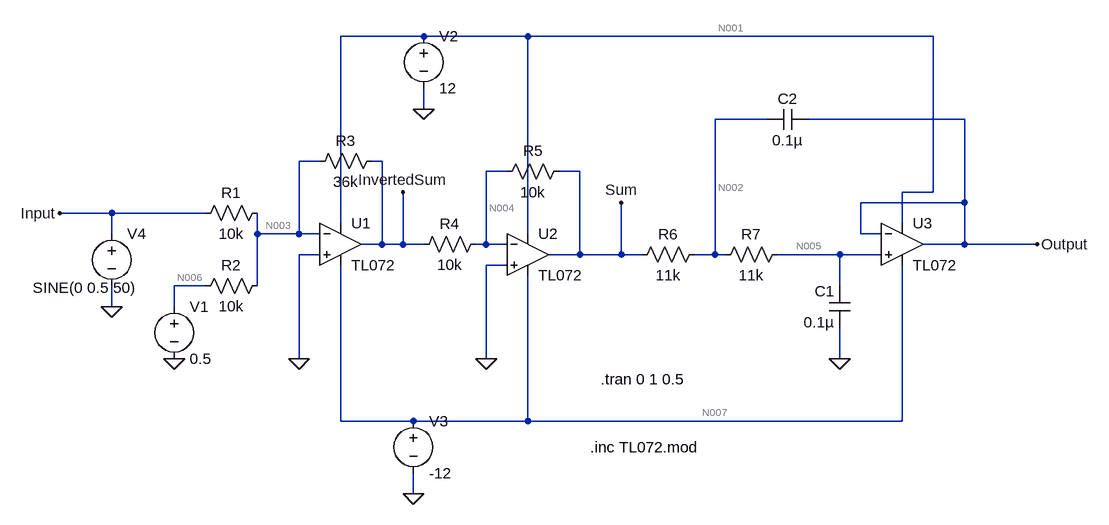
[diagram p0: schematic ELEC3400 Prac1.asc]
ELEC3400 Prac1.asc, the LTspice schematic file:
Version 4
SHEET 1 1468 680
WIRE 352 -176 224 -176
WIRE 512 -176 352 -176
WIRE 1136 -176 512 -176
WIRE 352 -64 352 -96
WIRE 880 -48 800 -48
WIRE 1184 -48 944 -48
WIRE 192 16 160 16
WIRE 288 16 272 16
WIRE 480 32 448 32
WIRE 592 32 560 32
WIRE 1136 64 1136 -176
WIRE 1136 64 1088 64
WIRE 1184 80 1184 -48
WIRE 1184 80 1024 80
WIRE -128 96 -208 96
WIRE 16 96 -128 96
WIRE 224 112 224 -176
WIRE 1088 112 1088 64
WIRE -128 128 -128 96
WIRE 96 128 96 96
WIRE 160 128 160 16
WIRE 160 128 96 128
WIRE 192 128 160 128
WIRE 512 128 512 -176
WIRE 1024 128 1024 80
WIRE 1056 128 1024 128
WIRE 288 144 288 16
WIRE 288 144 256 144
WIRE 320 144 320 64
WIRE 320 144 288 144
WIRE 352 144 320 144
WIRE 448 144 448 32
WIRE 448 144 432 144
WIRE 480 144 448 144
WIRE 1184 144 1184 80
WIRE 1184 144 1120 144
WIRE 1296 144 1184 144
WIRE 192 160 160 160
WIRE 592 160 592 32
WIRE 592 160 544 160
WIRE 656 160 656 80
WIRE 656 160 592 160
WIRE 688 160 656 160
WIRE 800 160 800 -48
WIRE 800 160 768 160
WIRE 816 160 800 160
WIRE 992 160 896 160
WIRE 1056 160 992 160
WIRE 480 176 448 176
WIRE 16 208 -32 208
WIRE 96 208 96 128
WIRE 992 208 992 160
WIRE -128 240 -128 208
WIRE -32 240 -32 208
WIRE 160 320 160 160
WIRE 448 320 448 176
WIRE 992 320 992 272
WIRE 224 416 224 176
WIRE 336 416 224 416
WIRE 512 416 512 192
WIRE 512 416 336 416
WIRE 1088 416 1088 176
WIRE 1088 416 512 416
WIRE 336 528 336 496
FLAG 160 320 0
FLAG 448 320 0
FLAG 992 320 0
FLAG 1296 144 Output
FLAG 352 -64 0
FLAG 336 528 0
FLAG -128 240 0
FLAG -208 96 Input
FLAG 320 64 InvertedSum
FLAG 656 80 Sum
FLAG -32 320 0
SYMBOL res 112 80 R90
WINDOW 0 0 56 VBottom 2
WINDOW 3 32 56 VTop 2
SYMATTR InstName R1
SYMATTR Value 10k
SYMBOL res 112 192 R90
WINDOW 0 0 56 VBottom 2
WINDOW 3 32 56 VTop 2
SYMATTR InstName R2
SYMATTR Value 10k
SYMBOL res 288 0 R90
WINDOW 0 0 56 VBottom 2
WINDOW 3 32 56 VTop 2
SYMATTR InstName R3
SYMATTR Value 36k
SYMBOL Opamps\\opamp2 224 80 R0
SYMATTR InstName U1
SYMATTR Value TL072
SYMBOL Opamps\\opamp2 512 96 R0
SYMATTR InstName U2
SYMATTR Value TL072
SYMBOL res 448 128 R90
WINDOW 0 0 56 VBottom 2
WINDOW 3 32 56 VTop 2
SYMATTR InstName R4
SYMATTR Value 10k
SYMBOL res 576 16 R90
WINDOW 0 0 56 VBottom 2
WINDOW 3 32 56 VTop 2
SYMATTR InstName R5
SYMATTR Value 10k
SYMBOL res 784 144 R90
WINDOW 0 0 56 VBottom 2
WINDOW 3 32 56 VTop 2
SYMATTR InstName R6
SYMATTR Value 11k
SYMBOL res 912 144 R90
WINDOW 0 0 56 VBottom 2
WINDOW 3 32 56 VTop 2
SYMATTR InstName R7
SYMATTR Value 11k
SYMBOL cap 1008 272 R180
WINDOW 0 24 56 Left 2
WINDOW 3 24 8 Left 2
SYMATTR InstName C1
SYMATTR Value 0.1µ
SYMBOL cap 880 -32 R270
WINDOW 0 32 32 VTop 2
WINDOW 3 0 32 VBottom 2
SYMATTR InstName C2
SYMATTR Value 0.1µ
SYMBOL Opamps\\opamp2 1088 80 R0
SYMATTR InstName U3
SYMATTR Value TL072
SYMBOL voltage -32 224 R0
WINDOW 123 0 0 Left 0
WINDOW 39 0 0 Left 0
SYMATTR InstName V1
SYMATTR Value 0.5
SYMBOL voltage 352 -192 R0
WINDOW 123 0 0 Left 0
WINDOW 39 0 0 Left 0
SYMATTR InstName V2
SYMATTR Value 12
SYMBOL voltage 336 400 R0
WINDOW 123 0 0 Left 0
WINDOW 39 0 0 Left 0
SYMATTR InstName V3
SYMATTR Value -12
SYMBOL voltage -128 112 R0
WINDOW 123 0 0 Left 0
WINDOW 39 0 0 Left 0
WINDOW 3 -122 99 Left 2
SYMATTR Value SINE(0 0.5 50)
SYMATTR InstName V4
TEXT 624 352 Left 2 !.tran 0 1 0.5
TEXT 608 456 Left 2 !.inc TL072.mod

The netlist it stands for:
* ELEC3400 Prac1.asc
R1 N003 Input 10k
R2 N003 N006 10k
R3 InvertedSum N003 36k
XU1 0 N003 N001 N007 InvertedSum TL072  ; pins In+ In- V+ V- OUT
XU2 0 N004 N001 N007 Sum TL072  ; pins In+ In- V+ V- OUT
R4 N004 InvertedSum 10k
R5 Sum N004 10k
R6 N002 Sum 11k
R7 N005 N002 11k
C1 0 N005 0.1µ
C2 N002 Output 0.1µ
XU3 N005 Output N001 N007 Output TL072  ; pins In+ In- V+ V- OUT
V1 N006 0 0.5
V2 N001 0 12
V3 N007 0 -12
V4 Input 0 SINE(0 0.5 50)
.tran 0 1 0.5
.inc TL072.mod
.backanno
.end

* Results of the author's LTspice run, read from the files saved beside the schematic
* Operating Point, zero values left out:
*   V(n003) = 19.12 µV
*   V(n006) = 500 mV
*   V(invertedsum) = -1.8 V
*   V(n007) = -12 V
*   V(n001) = 12 V
*   V(sum) = 1.8 V
*   V(n004) = 2.89 µV
*   V(n002) = 1.8 V
*   V(n005) = 1.8 V
*   V(output) = 1.8 V
*   I(R7) = -43.86 pA
*   I(R6) = -43.86 pA
*   I(R5) = 180 µA
*   I(R4) = 180 µA
*   I(R3) = -50 µA
*   I(R2) = -50 µA
*   I(R1) = 1.912 nA
*   I(V4) = 1.912 nA
*   I(V3) = 34.18 mA
*   I(V2) = -34.18 mA
*   I(V1) = -50 µA
*   Ix(u1:1) = 42.05 pA
*   Ix(u1:2) = 42.05 pA
*   Ix(u1:3) = 11.39 mA
*   Ix(u1:4) = -11.39 mA
*   Ix(u1:5) = 230 µA
*   Ix(u2:1) = 42.05 pA
*   Ix(u2:2) = 42.05 pA
*   Ix(u2:3) = 11.39 mA
*   Ix(u2:4) = -11.39 mA
*   Ix(u2:5) = -180 µA
*   Ix(u3:1) = 43.86 pA
*   Ix(u3:2) = 43.86 pA
*   Ix(u3:3) = 11.39 mA
*   Ix(u3:4) = -11.39 mA
*   Ix(u3:5) = -43.86 pA
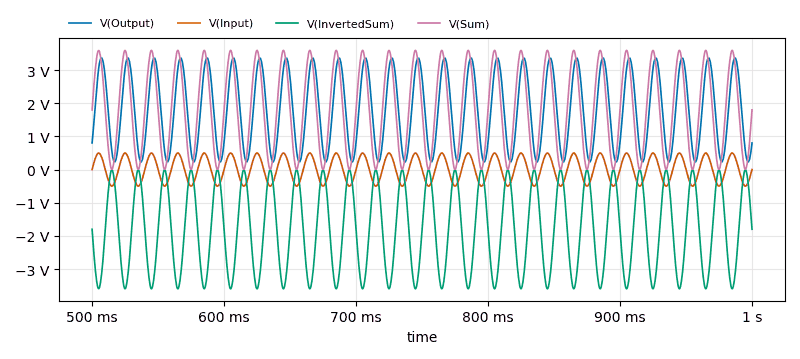
[diagram p1: Transient Analysis of ELEC3400 Prac1.asc, plotted from the saved traces]
* Transient Analysis, 1 run:
*   V(Output): min 227.8 mV, max 3.369 V, average 1.8 V, rms 2.119 V, last 803.1 mV
*   V(Input): min -497.4 mV, max 498.8 mV, average 42.17 µV, rms 349.8 mV, last 0 V
*   V(InvertedSum): min -3.595 V, max -9.169 mV, average -1.8 V, rms 2.197 V, last -1.8 V
*   V(Sum): min 9.188 mV, max 3.595 V, average 1.8 V, rms 2.197 V, last 1.8 V